# EAGLE design DRAM_POD_1 (EAGLE 9.5.2)
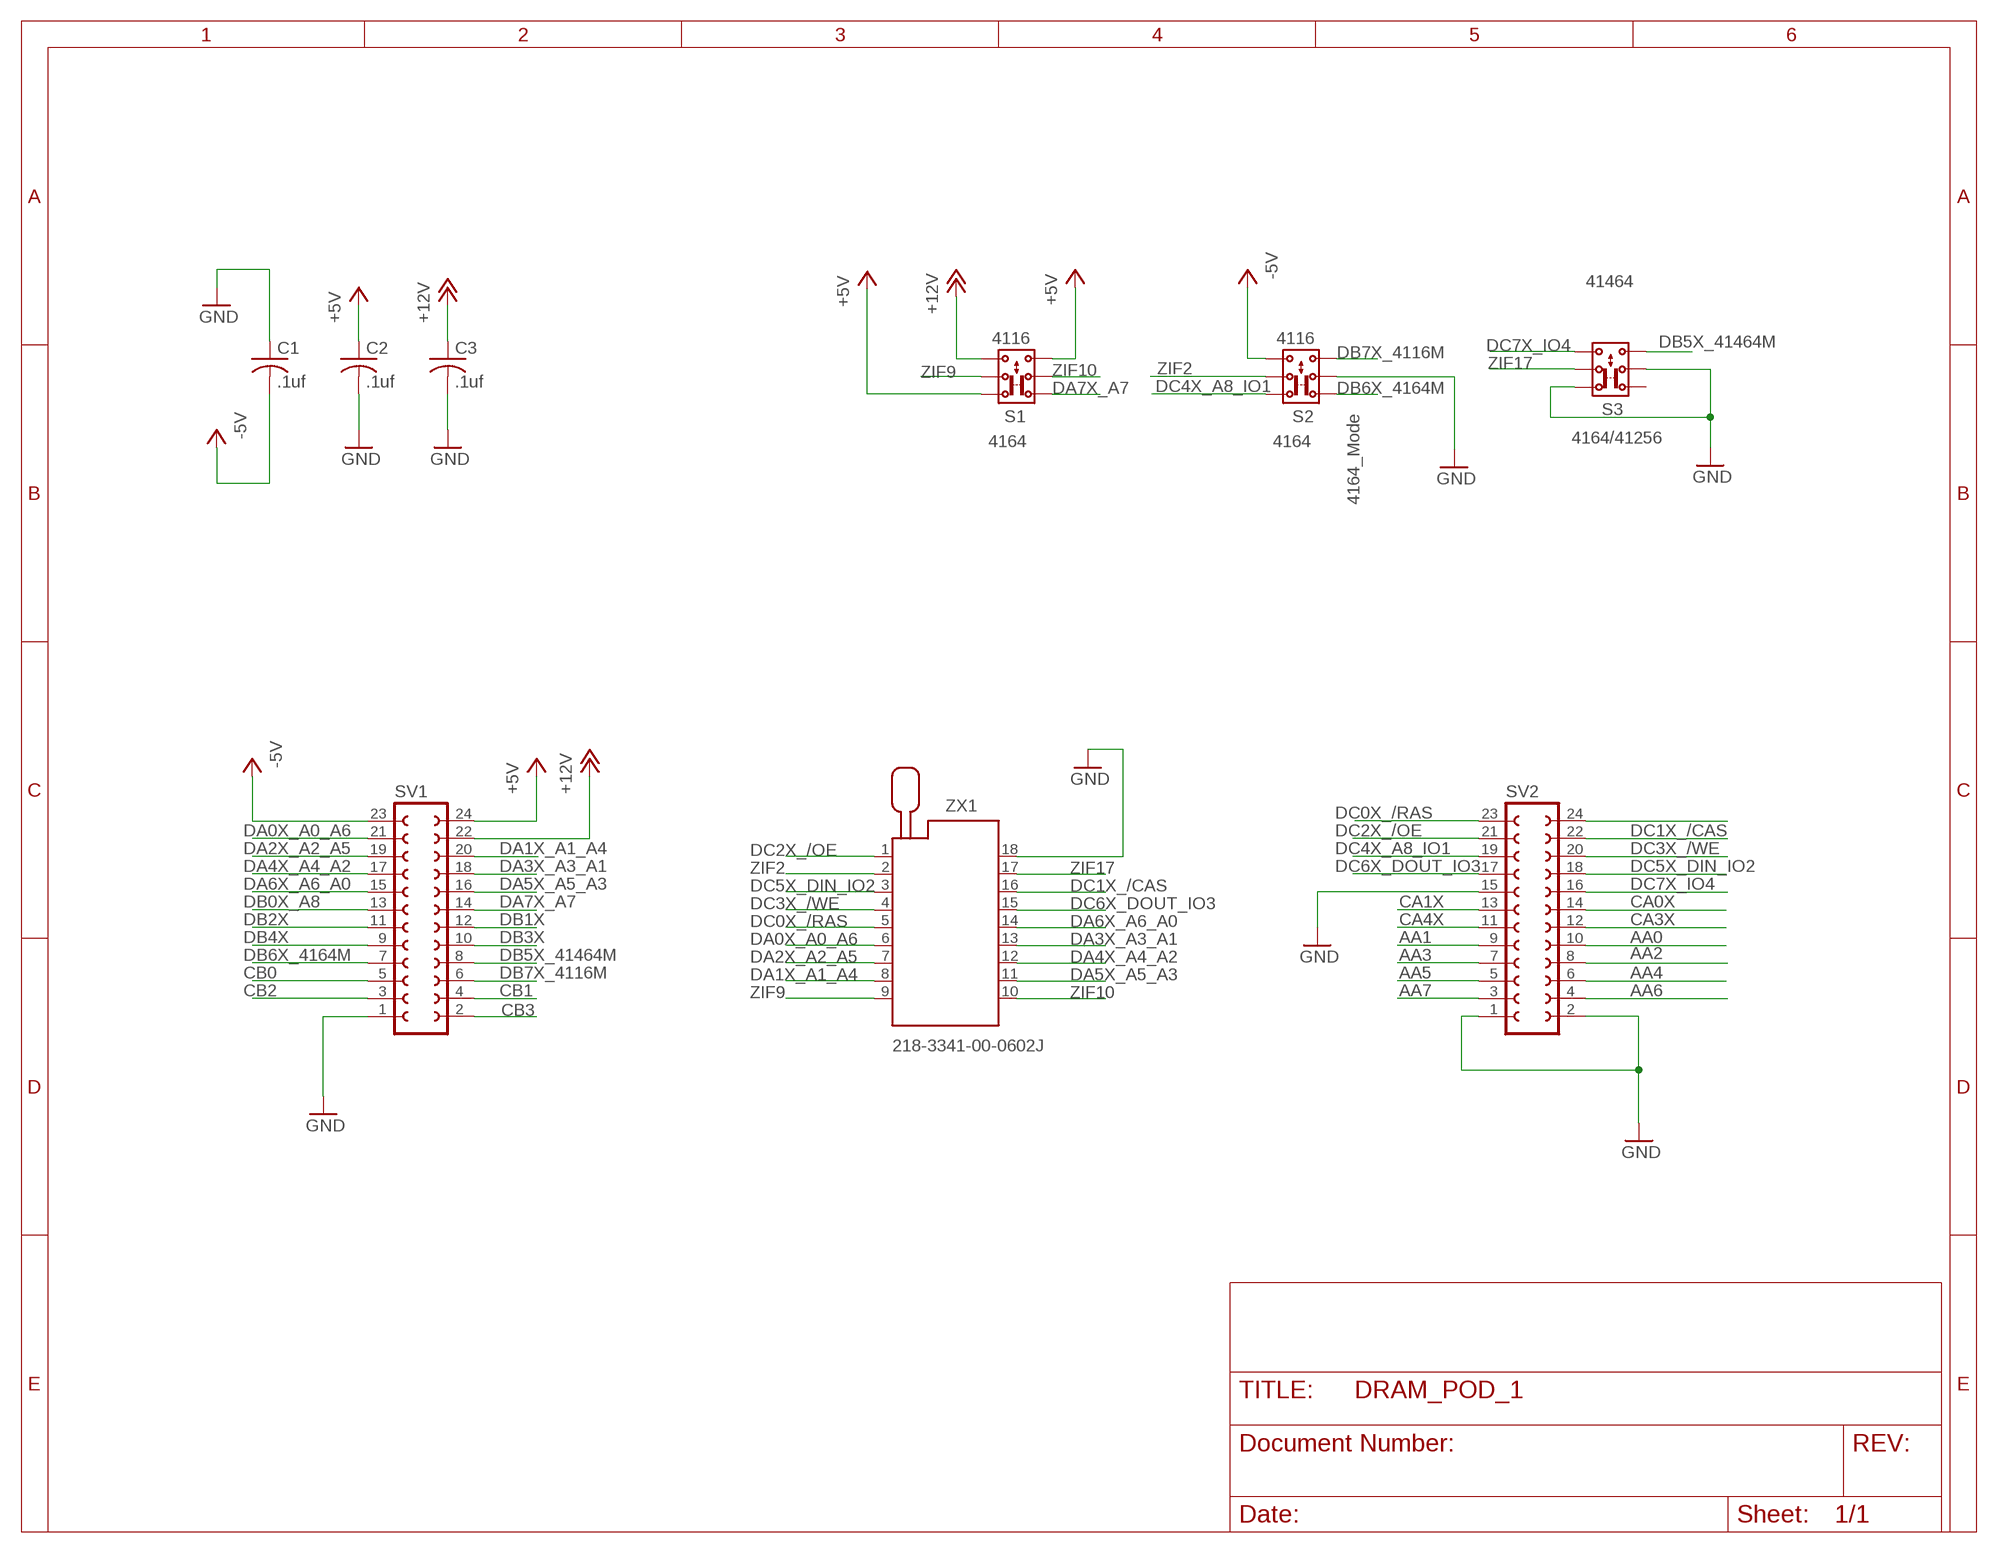
[diagram p0: schematic, sheet 1]

## Parts
C1  .1uf  C-US025-024X044  [C025-024X044]
C2  .1uf  C-US025-024X044  [C025-024X044]
C3  .1uf  C-US025-024X044  [C025-024X044]
S1  2P2T  [2P2T]
S2  2P2T  [2P2T]
S3  2P2T  [2P2T]
SV1  FE12-2  [FE12-2]
SV2  FE12-2  [FE12-2]
ZX1  218-3341-00-0602J  [218-3341-00-0602J]

## Nets
+5V: C2.1 S1.1.1 S1.3.2 SV1.24
+12V: C3.1 S1.3.1 SV1.22
-5V: C1.2 S2.3.1 SV1.23
AA0: SV2.10
AA1: SV2.9
AA2: SV2.8
AA3: SV2.7
AA4: SV2.6
AA5: SV2.5
AA6: SV2.4
AA7: SV2.3
CA0X: SV2.14
CA1X: SV2.13
CA3X: SV2.12
CA4X: SV2.11
CB0: SV1.5
CB1: SV1.4
CB2: SV1.3
CB3: SV1.2
DA0X_A0_A6: SV1.21 ZX1.6
DA1X_A1_A4: SV1.20 ZX1.8
DA2X_A2_A5: SV1.19 ZX1.7
DA3X_A3_A1: SV1.18 ZX1.13
DA4X_A4_A2: SV1.17 ZX1.12
DA5X_A5_A3: SV1.16 ZX1.11
DA6X_A6_A0: SV1.15 ZX1.14
DA7X_A7: S1.1.2 SV1.14
DB0X_A8: SV1.13
DB1X: SV1.12
DB2X: SV1.11
DB3X: SV1.10
DB4X: SV1.9
DB5X_41464M: S3.3.2 SV1.8
DB6X_4164M: S2.1.2 SV1.7
DB7X_4116M: S2.3.2 SV1.6
DC0X_/RAS: SV2.23 ZX1.5
DC1X_/CAS: SV2.22 ZX1.16
DC2X_/OE: SV2.21 ZX1.1
DC3X_/WE: SV2.20 ZX1.4
DC4X_A8_IO1: S2.1.1 SV2.19
DC5X_DIN_IO2: SV2.18 ZX1.3
DC6X_DOUT_IO3: SV2.17 ZX1.15
DC7X_IO4: S3.3.1 SV2.16
GND: C1.1 C2.2 C3.2 S2.2.2 S3.1.1 S3.2.2 SV1.1 SV2.1 SV2.2 SV2.15 ZX1.18
N$1: SV2.24
ZIF2: S2.2.1 ZX1.2
ZIF9: S1.2.1 ZX1.9
ZIF10: S1.2.2 ZX1.10
ZIF17: S3.2.1 ZX1.17
Unconnected: S3.1.2

## Notes on the sheet
- 41464
- 4116 | 4116
- 4164_Mode
- 4164 | 4164 | 4164/41256

## Library data of the parts
C1-C3 = rcl:C-US: CAPACITOR, American symbol; SPICEPREFIX: C
S1-S3 = MEGA-Tester:2P2T: SLIDE SWITCH 2P2T Part No. SS-22F05-G(A)4 Source: CANAL ELECTRONIC CO., LTD .. switsch.pdf
SV1 SV2 = con-lsta:FE12-2: FEMALE HEADER; OC_FARNELL: unknown; OC_NEWARK: unknown
ZX1 = con-3m:218-3341-00-0602J: Zero Insertion Force Socked Source: http://www.3M.com/ehpd; MF: 3M; MPN: 218-3341-00-0602J; OC_FARNELL: 9897461; OC_NEWARK: 85K7802

## Board
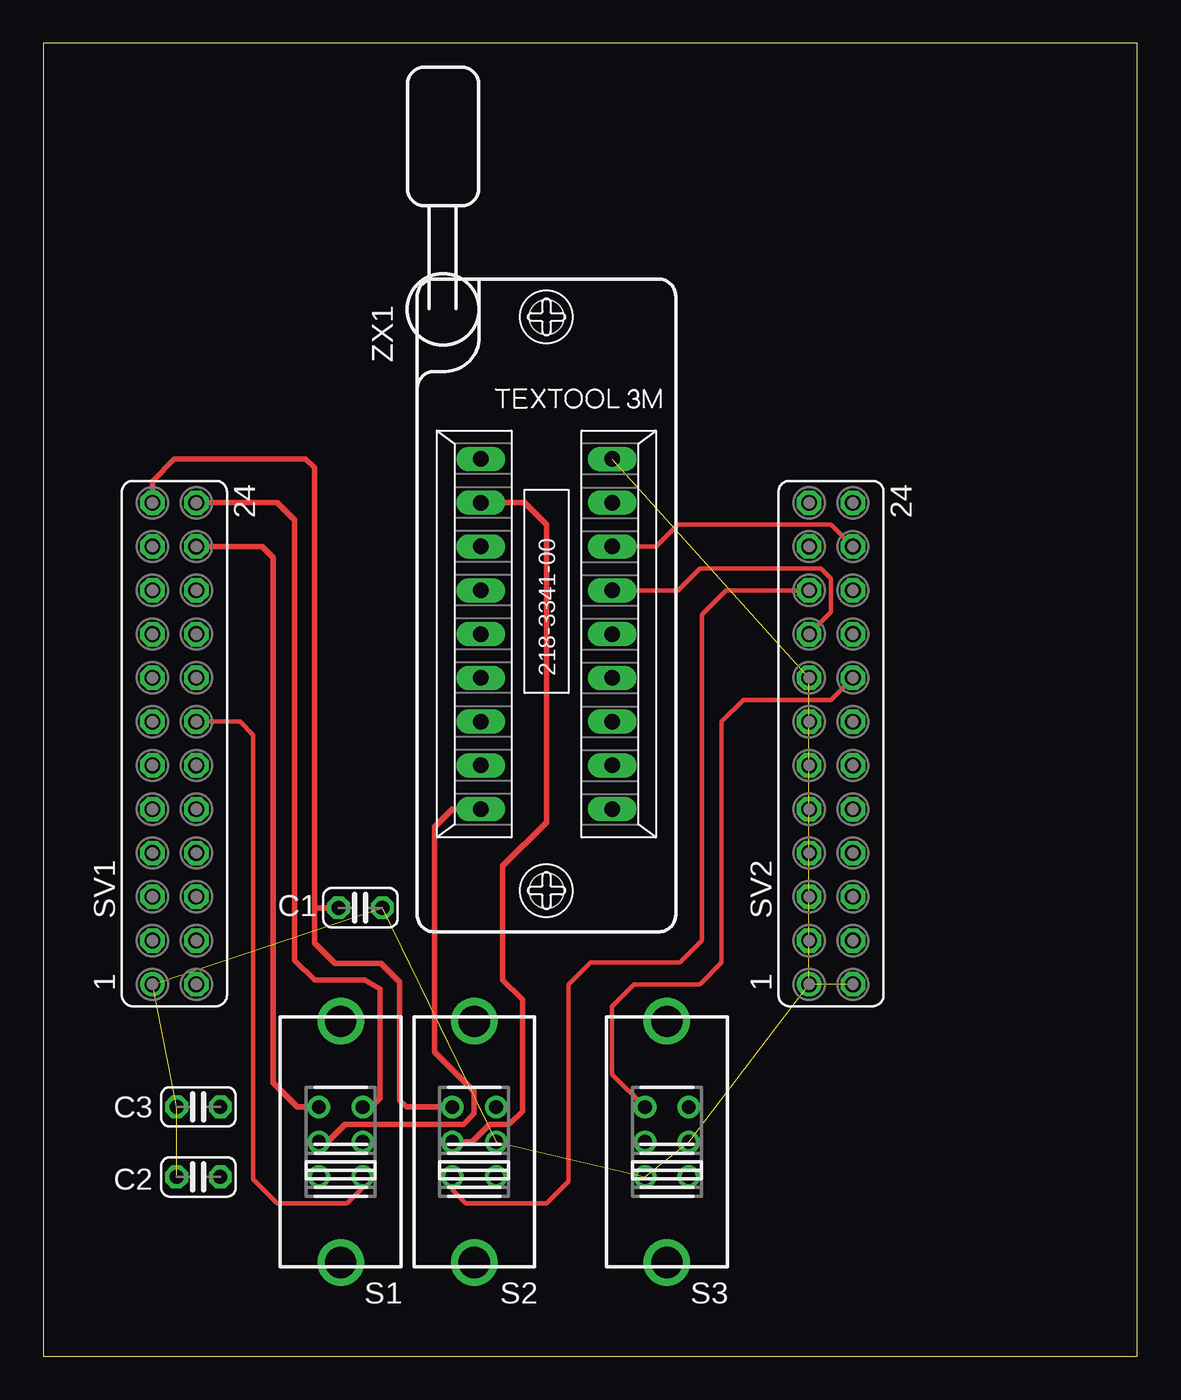
[diagram p1: board, top side]
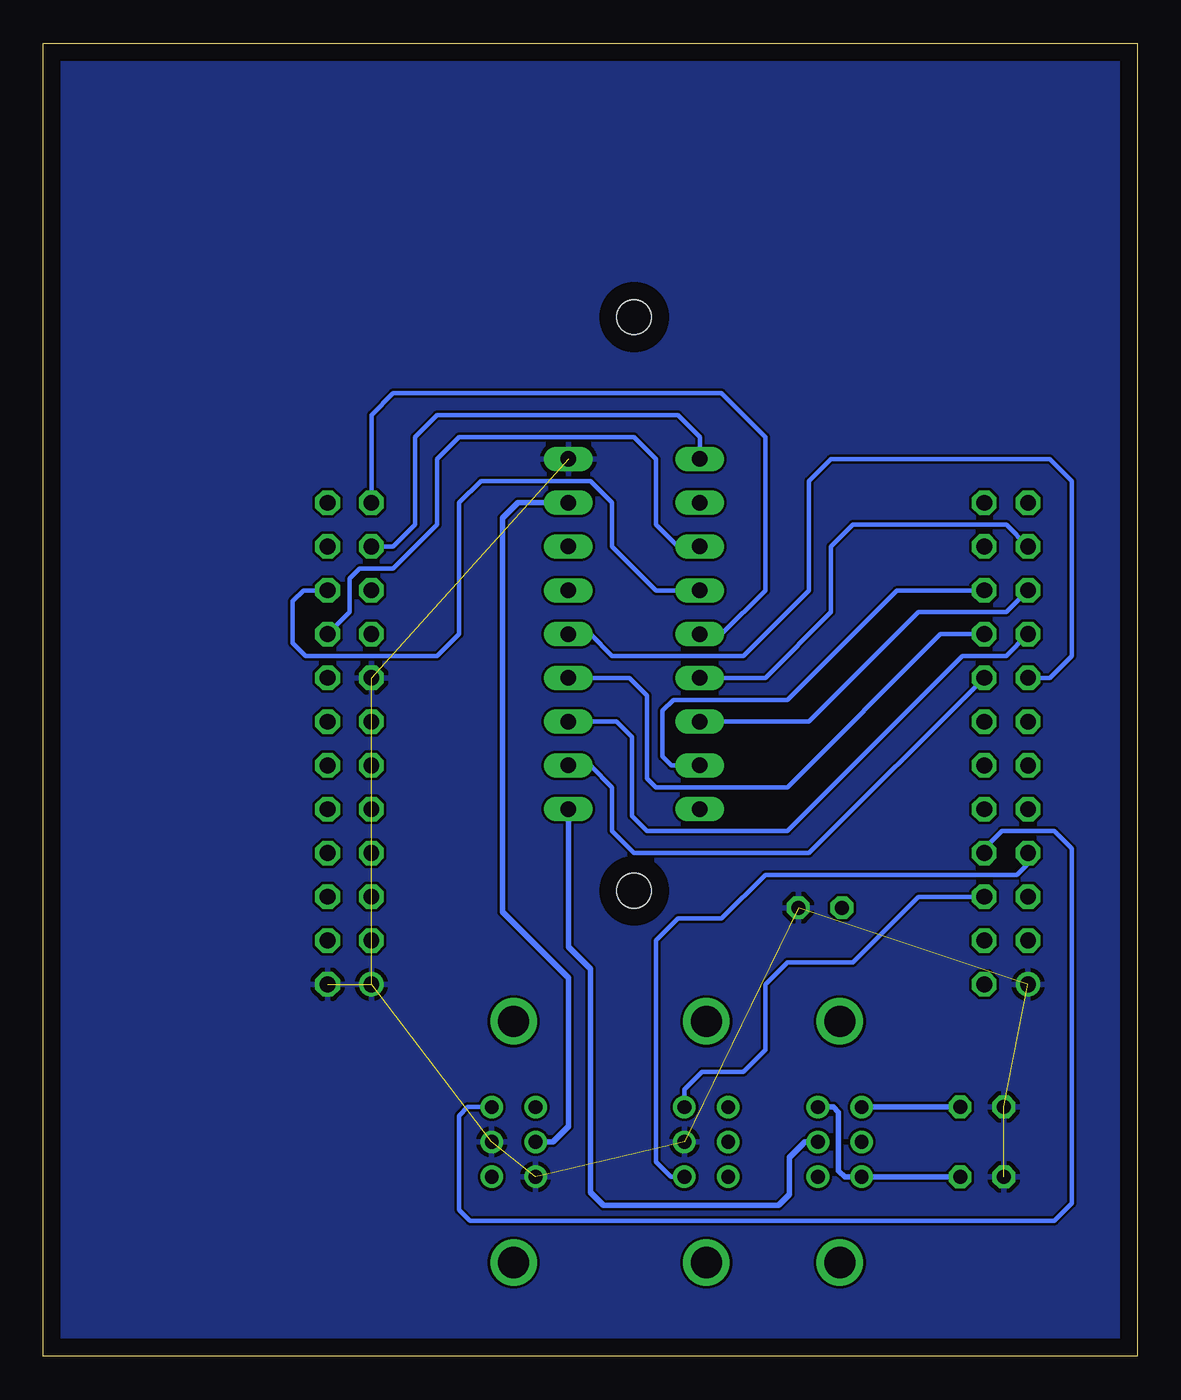
[diagram p2: board, bottom side, seen from below]

Size 63.5 x 76.2 mm. Coordinates in mm from the lower left corner, seen from the top.
Outline: 0,0 63.5,0 63.5,76.2 0,76.2 0,0
Copper layers (1*16): Top 0.035mm / dielectric 1.5mm / Bottom 0.035mm
Design rules "default": minimum track width 6mil, minimum drill 0.35mm, track to track 6mil, track to pad 6mil, pad to pad 6mil, via to via 6mil, smd to smd 6mil, copper to edge 40mil, drill to drill 6mil, minimum pad ring 10mil, minimum via ring 8mil, stop-mask expansion 4mil, vias tented up to drill 0mil, thermal gap 10mil

### Footprints (pad centres in the part's own frame; a part is rotated, then mirrored left to right if it is on the bottom)
C025-024X044 = drill 0.813 octagon: 1 -1.27,0; 2 1.27,0
2P2T = drill 0.8: 1.1 -2.024,1.27; 1.2 -2.024,-1.27; 2.1 0,1.27; 2.2 0,-1.27; 3.1 2.024,1.27; 3.2 2.024,-1.27 | drill 1.803: P$1 -6.998,0; P$2 6.998,0
FE12-2 = drill 0.914: 1 -13.97,1.27 | drill 0.914 octagon: 2 -13.97,-1.27; 3 -11.43,1.27; 4 -11.43,-1.27; 5 -8.89,1.27; 6 -8.89,-1.27; 7 -6.35,1.27; 8 -6.35,-1.27; 9 -3.81,1.27; 10 -3.81,-1.27; 11 -1.27,1.27; 12 -1.27,-1.27; 13 1.27,1.27; 14 1.27,-1.27; 15 3.81,1.27; 16 3.81,-1.27; 17 6.35,1.27; 18 6.35,-1.27; 19 8.89,1.27; 20 8.89,-1.27; 21 11.43,1.27; 22 11.43,-1.27; 23 13.97,1.27; 24 13.97,-1.27
218-3341-00-0602J = drill 0.9 long: 1 -10.16,-3.81; 2 -7.62,-3.81; 3 -5.08,-3.81; 4 -2.54,-3.81; 5 0,-3.81; 6 2.54,-3.81; 7 5.08,-3.81; 8 7.62,-3.81; 9 10.16,-3.81; 10 10.16,3.81; 11 7.62,3.81; 12 5.08,3.81; 13 2.54,3.81; 14 0,3.81; 15 -2.54,3.81; 16 -5.08,3.81; 17 -7.62,3.81; 18 -10.16,3.81 | hole 2: 14.89,0; -18.39,0

### Placement (x,y rotation side)
C1  18.41,26.04 180 top
C2  9.02,10.41 180 top
C3  9.02,14.48 180 top
S1  17.27,12.45 90 top
S2  25.02,12.45 90 top
S3  36.2,12.45 90 top
SV1  7.62,35.56 90 top
SV2  45.72,35.56 90 top
ZX1  29.21,41.91 270 top

### Tracks (layer width: path | path; a pad name or v marks a point on that pad's centre or on a via)
+5V
  Top 0.305: SV1.24 13.59,49.53 14.61,48.51 14.61,22.99 15.75,21.84 18.67,21.84 19.56,21.32 19.56,14.99 19.04,14.47 S1.3.2
  Bottom 0.305: S1.3.2 17.64,14.47 17.34,14.17 17.34,10.78 16.98,10.42 S1.1.1 C2.1
+12V
  Top 0.305: SV1.22 12.7,46.99 13.34,46.35 13.34,15.88 14.74,14.47 S1.3.1
  Bottom 0.305: C3.1 S1.3.1
-5V
  Top 0.305: SV1.23 6.35,50.8 7.62,52.07 15.24,52.07 15.75,51.56 15.75,26.04 | 15.75,26.04 15.75,24 16.95,22.8 19.62,22.8 20.7,21.72 20.7,14.86 21.08,14.47 S2.3.1 | C1.2 15.75,26.04
DA0X_A0_A6
  Bottom 0.254: SV1.21 7.62,48.26 16.51,48.26 17.78,46.99 17.78,43.18 21.59,39.37 ZX1.6
DA1X_A1_A4
  Bottom 0.254: SV1.20 13.97,44.45 20.32,38.1 26.92,38.1 27.56,37.47 27.56,34.8 27.05,34.29 ZX1.8
DA2X_A2_A5
  Bottom 0.254: SV1.19 7.62,43.18 12.7,43.18 19.05,36.83 ZX1.7
DA3X_A3_A1
  Bottom 0.254: SV1.18 11.43,41.91 20.32,33.02 27.94,33.02 28.45,33.53 28.45,38.35 29.46,39.37 ZX1.13
DA4X_A4_A2
  Bottom 0.254: ZX1.12 30.23,36.83 29.34,35.94 29.34,31.37 28.45,30.48 20.32,30.48 10.16,40.64 7.62,40.64 SV1.17
DA5X_A5_A3
  Bottom 0.254: ZX1.11 31.75,34.29 30.48,33.02 30.48,30.48 29.21,29.21 19.05,29.21 SV1.16
DA6X_A6_A0
  Bottom 0.254: ZX1.14 31.75,41.91 30.48,40.64 22.86,40.64 19.05,44.45 19.05,50.8 17.78,52.07 5.08,52.07 3.81,50.8 3.81,40.64 5.08,39.37 SV1.15
DA7X_A7
  Top 0.254: S1.1.2 18.54,9.79 17.64,8.89 13.59,8.89 12.19,10.29 12.19,36.07 11.43,36.83 SV1.14
DB5X_41464M
  Bottom 0.254: S3.3.2 38.87,14.47 39.37,13.97 39.37,8.51 38.73,7.87 4.83,7.87 3.81,8.89 3.81,29.46 4.83,30.48 7.87,30.48 8.89,29.46 SV1.8
DB6X_4164M
  Bottom 0.254: S2.1.2 27.06,10.42 27.94,11.3 27.94,24.13 26.67,25.4 24.13,25.4 21.59,27.94 6.99,27.94 6.35,28.57 SV1.7
DB7X_4116M
  Bottom 0.254: S2.3.2 26.29,15.49 25.27,16.51 22.86,16.51 21.59,17.78 21.59,21.59 20.32,22.86 16.51,22.86 12.7,26.67 SV1.6
DC0X_/RAS
  Bottom 0.254: ZX1.5 24.13,41.91 21.59,44.45 21.59,53.34 24.13,55.88 43.18,55.88 44.45,54.61 SV2.23
DC1X_/CAS
  Top 0.254: SV2.22 45.72,48.26 36.83,48.26 35.56,46.99 ZX1.16
DC2X_/OE
  Bottom 0.254: SV2.21 43.18,46.99 41.91,48.26 41.91,53.34 40.64,54.61 26.67,54.61 25.4,53.34 ZX1.1
DC3X_/WE
  Bottom 0.254: ZX1.4 27.94,44.45 30.48,46.99 30.48,49.53 31.75,50.8 38.1,50.8 39.37,49.53 39.37,41.91 40.64,40.64 48.26,40.64 49.02,41.4 49.02,43.81 48.39,44.45 SV2.20
DC4X_A8_IO1
  Top 0.254: S2.1.1 23.75,9.66 24.52,8.89 29.21,8.89 30.48,10.16 30.48,21.59 31.75,22.86 36.96,22.86 38.23,24.13 38.23,43.05 39.62,44.45 SV2.19
DC5X_DIN_IO2
  Bottom 0.254: ZX1.3 26.67,46.99 27.94,48.26 27.94,52.07 29.21,53.34 39.37,53.34 40.64,52.07 40.64,48.26 43.18,45.72 45.12,45.72 45.72,45.12 45.72,43.18 SV2.18
DC6X_DOUT_IO3
  Top 0.254: SV2.17 45.72,43.18 45.72,45.12 45.12,45.72 38.1,45.72 36.83,44.45 ZX1.15
DC7X_IO4
  Top 0.254: S3.3.1 33.02,16.38 33.02,20.32 34.29,21.59 38.1,21.59 39.37,22.86 39.37,36.83 40.64,38.1 45.72,38.1 SV2.16
GND  (10 unrouted)
  pour Bottom: -2.54,77.47 69.85,77.47 69.85,-5.21 -2.54,-5.21
ZIF2
  Top 0.305: S2.2.1 24.89,12.45 25.91,13.46 27.05,13.46 27.81,14.22 27.81,20.7 26.67,21.84 26.67,28.45 29.21,30.99 29.21,48.26 27.94,49.53 ZX1.2
ZIF9
  Top 0.305: S1.2.1 16.51,12.45 17.53,13.46 24.38,13.46 25.02,14.1 25.02,15.37 22.73,17.66 22.73,30.73 23.75,31.75 ZX1.9
ZIF10
  Bottom 0.305: S1.2.2 19.3,12.45 20.19,11.56 20.19,9.4 20.83,8.76 30.99,8.76 31.75,9.53 31.75,22.48 33.02,23.75 ZX1.10
ZIF17
  Bottom 0.305: S3.2.1 33.91,12.45 33.02,13.34 33.02,21.97 36.83,25.78 36.83,48.64 35.94,49.53 ZX1.17